# EAGLE design RGB_PMOLED_0.6IN (EAGLE 9.0.1)
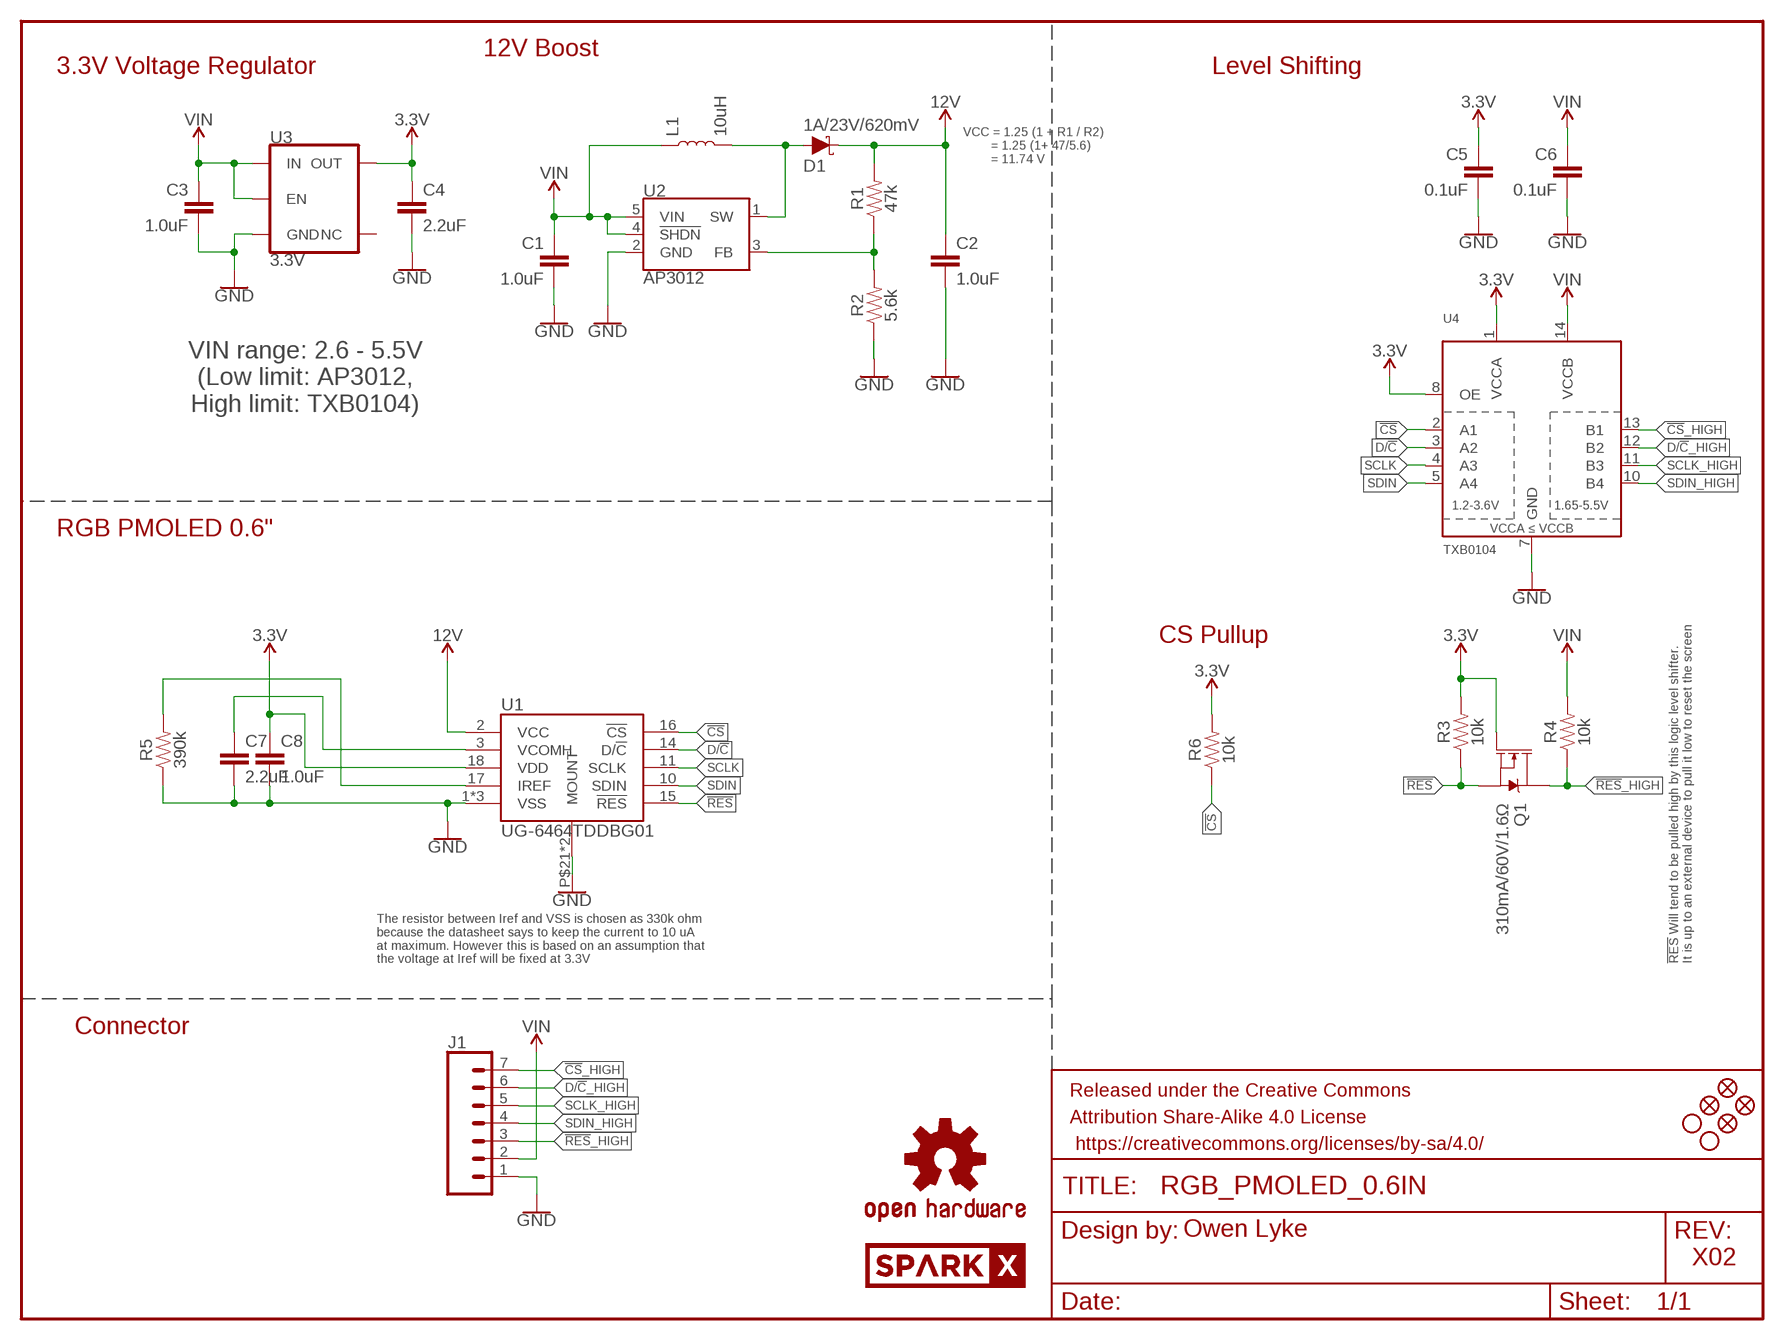
[diagram p0: schematic, sheet 1]

## Parts
C1  1.0uF  1.0UF-0603-16V-10%  [0603]
C2  1.0uF  1.0UF-0603-16V-10%  [0603]
C3  1.0uF  1.0UF-0603-16V-10%  [0603]
C4  2.2uF  2.2UF-0603-10V-20%  [0603]
C5  0.1uF  0.1UF-0603-25V-(+80/-20%)  [0603]
C6  0.1uF  0.1UF-0603-25V-(+80/-20%)  [0603]
C7  2.2uF  2.2UF-0805-25V-(+80/-20%)  [0805]
C8  1.0uF  1.0UF-0603-16V-10%  [0603]
D1  1A/23V/620mV  DIODE-SCHOTTKY-BAT20J  [SOD-323]
FD1  FIDUCIAL1X2  [FIDUCIAL-1X2]
FD2  FIDUCIAL1X2  [FIDUCIAL-1X2]
FD3  FIDUCIAL1X2  [FIDUCIAL-1X2]
FD4  FIDUCIAL1X2  [FIDUCIAL-1X2]
FRAME1  FRAME-LETTER  [CREATIVE_COMMONS]
H1  STAND-OFF  [STAND-OFF]
H2  STAND-OFF  [STAND-OFF]
J1  CONN_07NO_SILK  [1X07_NO_SILK]
L1  10uH  INDUCTOR-CDRH-10UH  [INDUCTOR_4.7UH]
LOGO1  SPARKX-LOGO5  [SPARKX-LARGE]
LOGO2  OSHW-LOGOS  [OSHW-LOGO-S]
Q1  310mA/60V/1.6Ω  MOSFET-NCH-2N7002PW  [SOT323]
R1  47k  47KOHM-0603-1/10W-1%  [0603]
R2  5.6k  5.6KOHM-0603-1/10W-1%  [0603]
R3  10k  10KOHM-0603-1/10W-1%  [0603]
R4  10k  10KOHM-0603-1/10W-1%  [0603]
R5  390k  390KOHM-0603-1/10W-1%  [0603]
R6  10k  10KOHM-0603-1/10W-1%  [0603]
U1  UG-6464TDDBG01  [AMPHENOL_10051922-2010ELF]
U2  AP3012  [SOT23-5]
U3  3.3V  V_REG_AP2112K-3.3V  [SOT23-5]
U4  TXB0104  TXB0104PWRSOIC14  [SO14]

## Nets
3.3V: C4.1 C5.1 C8.1 Q1.1(G) R3.2 R6.2 U1.18(VDD) U3.5(OUT) U4.1(VCCA) U4.8(OE)
12V: C2.1 D1.C R1.2 U1.2(VCC)
!CS: R6.1 U1.16(!CS) U4.2(A1)
!CS!_HIGH: J1.7 U4.13(B1)
!RES: Q1.2(S) R3.1 U1.15(!RES)
!RES!_HIGH: J1.3 Q1.3(D) R4.1
D/!C: U1.14(D/!C) U4.3(A2)
D/!C!_HIGH: J1.6 U4.12(B2)
GND: C1.2 C2.2 C3.2 C4.2 C5.2 C6.2 C7.2 C8.2 J1.1 R2.1 R5.1 U1.1(VSS) U1.19(VSS) U1.20(VSS) U1.P$21(MOUNT) U1.P$22(MOUNT) U2.2(GND) U3.2(GND) U4.7(GND)
N$2: D1.A L1.P$2 U2.1(SW)
N$3: R1.1 R2.2 U2.3(FB)
N$5: C7.1 U1.3(VCOMH)
N$11: R5.2 U1.17(IREF)
SCLK: U1.11(SCLK) U4.4(A3)
SCLK_HIGH: J1.5 U4.11(B3)
SDIN: U1.10(SDIN) U4.5(A4)
SDIN_HIGH: J1.4 U4.10(B4)
VIN: C1.1 C3.1 C6.1 J1.2 L1.P$1 R4.2 U2.4(!SHDN!) U2.5(VIN) U3.1(IN) U3.3(EN) U4.14(VCCB)
Unconnected: U3.4(NC)

## Notes on the sheet
- 12V Boost
- 3.3V Voltage Regulator | Level Shifting
- VCC = 1.25 (1 + R1 / R2)
          = 1.25 (1+ 47/5.6)
          = 11.74 V
- VIN range: 2.6 - 5.5V
  (Low limit: AP3012,
  High limit: TXB0104)
- RGB PMOLED 0.6"
- CS Pullup
- The resistor between Iref and VSS is chosen as 330k ohm 
  because the datasheet says to keep the current to 10 uA 
  at maximum. However this is based on an assumption that 
  the voltage at Iref will be fixed at 3.3V
- !RES! Will tend to be pulled high by this logic level shifter. 
  It is up to an external device to pull it low to reset the screen
- Connector
- Owen Lyke
- X02

## Library data of the parts
C1-C3 C8 = SparkFun-Capacitors:1.0UF: 1µF ceramic capacitors A capacitor is a passive two-terminal electrical component used to store electrical energy temporarily in an electric field.; PROD_ID: CAP-00868
C4 = SparkFun-Capacitors:2.2UF: 2.2µF ceramic capacitors A capacitor is a passive two-terminal electrical component used to store electrical energy temporarily in an electric field.; PROD_ID: CAP-07888
C5 C6 = SparkFun-Capacitors:0.1UF: 0.1µF ceramic capacitors A capacitor is a passive two-terminal electrical component used to store electrical energy temporarily in an electric field.; PROD_ID: CAP-00810
C7 = SparkFun-Capacitors:2.2UF: 2.2µF ceramic capacitors A capacitor is a passive two-terminal electrical component used to store electrical energy temporarily in an electric field.; PROD_ID: CAP-11624
D1 = SparkFun-DiscreteSemi:DIODE-SCHOTTKY: Schottky diode A Schottky diode is a semiconductor diode which has a low forward voltage drop and a very fast switching action.; PROD_ID: DIO-11623
FD1-FD4 = SparkFun-Aesthetics:FIDUCIAL: Fiducial Alignment Points Point-of-reference for pick-and-place machines and other optical instruments.
FRAME1 = SparkFun-Aesthetics:FRAME-LETTER: Schematic Frame - Letter Standard 8.5x11 US Letter frame
H1 H2 = SparkFun-Hardware:STAND-OFF: Stand Off Drill holes for mechanically mounting via screws, standoffs, etc. Note: Use the keepout ring to avoid running the screw head into surrounding components. Variant Overviews STAND-OFF - Mechanical footprint for a #4 phillips button head screw. STAND-OFF-TIGHT - Mechanical footprint for a #4 phillips button head screw, Example SparkFun Products Screw - Phillips Head (1/4", 4-40, 10 pack) <https://www.sparkfun.com/products/10453> (PRT-10453) Screw - Phillips Head (1/2", 4-40, 10 pack) <https://www.sparkfun.com/products/10452> (PRT-10452) Screw - Phillips Head (3/4", 4-40, 10 pack) <https://www.sparkfun.com/products/10451> (PRT-10451) Screw - Phillips Head (1", 4-40, 10 pack) <https://www.sparkfun.com/products/10450> (PRT-10450)
J1 = SparkFun-Connectors:CONN_07: Multi connection point. Often used as Generic Header-pin footprint for 0.1 inch spaced/style header connections On any of the 0.1 inch spaced packages, you can populate with these: Break Away Headers - Straight <https://www.sparkfun.com/products/116> (PRT-00116) Break Away Male Headers - Right Angle <https://www.sparkfun.com/products/553> (PRT-00553) Female Headers <https://www.sparkfun.com/products/115> (PRT-00115) Break Away Headers - Machine Pin <https://www.sparkfun.com/products/117> (PRT-00117) Break Away Female Headers - Swiss Machine Pin <https://www.sparkfun.com/products/743> (PRT-00743) For SCREWTERMINALS and SPRING TERMINALS visit here: Screw Terimnals on SparkFun.com <https://www.sparkfun.com/search/results?term=Screw+Terminals> (5mm/3.5mm/2.54mm spacing) This device is also useful as a general connection point to wire up your design to another part of your project. Our various solder wires solder well into these plated through hole pads. Hook-Up Wire - Assortment (Stranded, 22 AWG) <https://www.sparkfun.com/products/11375> (PRT-11375) Hook-Up Wire - Assortment (Solid Core, 22 AWG) <https://www.sparkfun.com/products/11367> (PRT-11367) View the entire wire category on our website here <https://www.sparkfun.com/categories/141> Special notes: Molex polarized connector foot print use with SKU : PRT-08231 with associated crimp pins and housings. 1MM SMD Version SKU: PRT-10208 NOTES ON THE VARIANTS LOCK and LOCK_LONGPADS... This footprint was designed to help hold the alignment of a through-hole component (i.e. 6-pin header) while soldering it into place. You may notice that each hole has been shifted either up or down by 0.005 of an inch from it's more standard position (which is a perfectly straight line). This slight alteration caused the pins (the squares in the middle) to touch the edges of the holes. Because they are alternating, it causes a "brace" to hold the component in place. 0.005 has proven to be the perfect amount of "off-center" position when using our standard breakaway headers. Although looks a little odd when you look at the bare footprint, once you have a header in there, the alteration is very hard to notice. Also,if you push a header all the way into place, it is covered up entirely on the bottom side.
L1 = SparkFun-Coils:INDUCTOR: Inductors Resist changes in electrical current. Basically a coil of wire. SparkFun Products: SparkFun Load Cell Amplifier - HX711 <https://www.sparkfun.com/products/13879> IOIO-OTG - V2.2 <https://www.sparkfun.com/products/13613>; PROD_ID: NDUC-13968
LOGO1 = 1.81_Greyscale_OLED_Breakout:SPARKX-LOGO
LOGO2 = SparkFun-Aesthetics:OSHW-LOGO: Open-Source Hardware (OSHW) Logo This logo indicates the piece of hardware it is found on incorporates a OSHW license and/or adheres to the definition of open source hardware found here: http://freedomdefined.org/OSHW
Q1 = SparkFun-DiscreteSemi:MOSFET-NCH: N-channel MOSFETs Voltage controlled devices that allow control of high current outputs. SparkFun Products: SparkFun OpenScale <https://www.sparkfun.com/products/13261> SparkFun Digital Sandbox <https://www.sparkfun.com/products/12651> SparkFun Monster Moto Shield <https://www.sparkfun.com/products/10182> SparkFun MOSFET Power Controller <https://www.sparkfun.com/products/11214>; PROD_ID: TRANS-11151
R1 = SparkFun-Resistors:47KOHM: 47kΩ resistor A resistor is a passive two-terminal electrical component that implements electrical resistance as a circuit element. Resistors act to reduce current flow, and, at the same time, act to lower voltage levels within circuits. - Wikipedia; PROD_ID: RES-07871
R2 = SparkFun-Resistors:5.6KOHM: 5.6kΩ resistor A resistor is a passive two-terminal electrical component that implements electrical resistance as a circuit element. Resistors act to reduce current flow, and, at the same time, act to lower voltage levels within circuits. - Wikipedia; PROD_ID: RES-12378
R3 R4 R6 = SparkFun-Resistors:10KOHM: 10kΩ resistor A resistor is a passive two-terminal electrical component that implements electrical resistance as a circuit element. Resistors act to reduce current flow, and, at the same time, act to lower voltage levels within circuits. - Wikipedia; PROD_ID: RES-00824
R5 = SparkFun-Resistors:390KOHM: 390kΩ resistor A resistor is a passive two-terminal electrical component that implements electrical resistance as a circuit element. Resistors act to reduce current flow, and, at the same time, act to lower voltage levels within circuits. - Wikipedia; PROD_ID: RES-12024
U1 = RGB_OLED:UG-6464TDDBG01
U2 = SparkFun-IC-Power:AP3012: AP3012 The AP3012 is a high power, constant frequency, current mode PWM, inductor based, step-up (boost) converter. The converter operates at high frequency (1.5MHz) so that a small, low profile inductor can be used. Datasheet <https://www.diodes.com/assets/Datasheets/AP3012.pdf>; PROD_ID: VREG-13911
U3 = SparkFun-IC-Power:V_REG_AP2112: AP2112 - 600mA CMOS LDO Regulator w/ Enable The AP2112 is CMOS process low dropout linear regulator with enable function, the regulator delivers a guaranteed 600mA (min.) continuous load current. Features Output Voltage Accuracy: ±1.5% Output Current: 600mA (Min.) Foldback Short Current Protection: 50mA Enable Function to Turn ON/OFF VOUT Low Dropout Voltage (3.3V): 250mV (Typ.) @IOUT=600mA Excellent Load Regulation: 0.2%/A (Typ.) Excellent Line Regulation: 0.02%/V (Typ.) Low Quiescent Current: 55μA (Typ.) Low Standby Current: 0.01μA (Typ.) Low Output Noise: 50μVRMS PSRR: 100Hz -65dB, 1kHz -65dB OTSD Protection Stable with 1.0μF Flexible Cap: Ceramic, Tantalum and Aluminum Electrolytic Operation Temperature Range: -40°C to 85°C ESD: MM 400V, HBM 4000V; PROD_ID: VREG-12457
U4 = SparkFun-IC-Comms:TXB0104PWR: 4-Bit Bi-Directional Level Shifter 1.2V-3.6V (VCCA) to 1.65V-5.5V (VCCB) bi-directional level shifter with auto direction sensing. Max data rate - VCCA 1.8V: 20Mbps (50ns), VCCA 3.3V: 100Mbps (10ns) Digikey: 296-21929-1-ND (TSSOP) Datasheet <http://cdn.sparkfun.com/datasheets/BreakoutBoards/txb0104.pdf> SparkFun Products SparkFun Cellular Shield - MG2639 <https://www.sparkfun.com/products/13120> (CEL-13120) SparkFun Level Shifting microSD Breakout <https://www.sparkfun.com/products/13743> (DEV-13743) SparkFun Voltage-Level Translator Breakout - TXB0104 <https://www.sparkfun.com/products/11771> (BOB-11771) SparkFun Block for Intel® Edison - UART <https://www.sparkfun.com/products/13040> (DEV-13040) SparkFun Block for Intel® Edison - Arduino <https://www.sparkfun.com/products/13036> (DEV-13036); PROD_ID: IC-11329

## Board
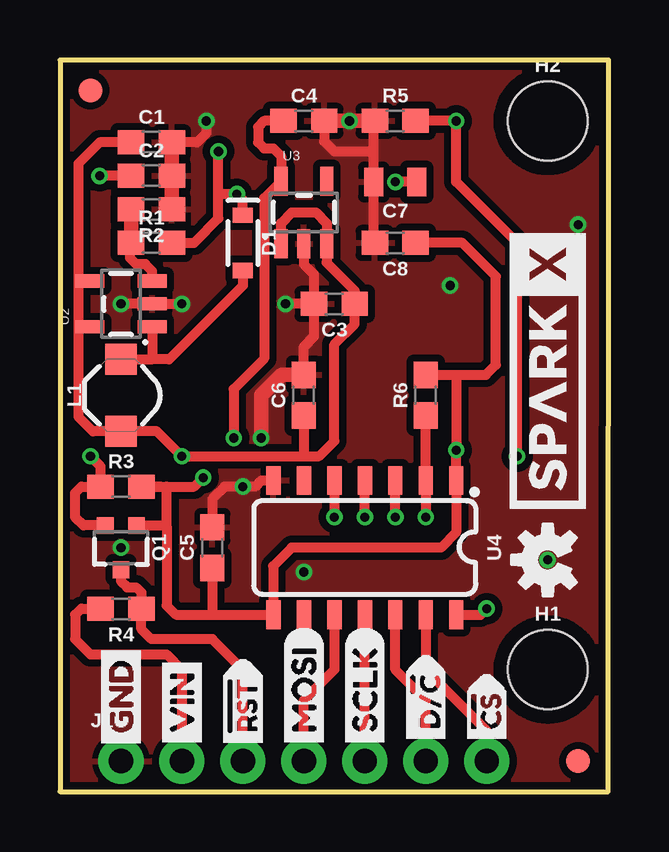
[diagram p1: board, top side]
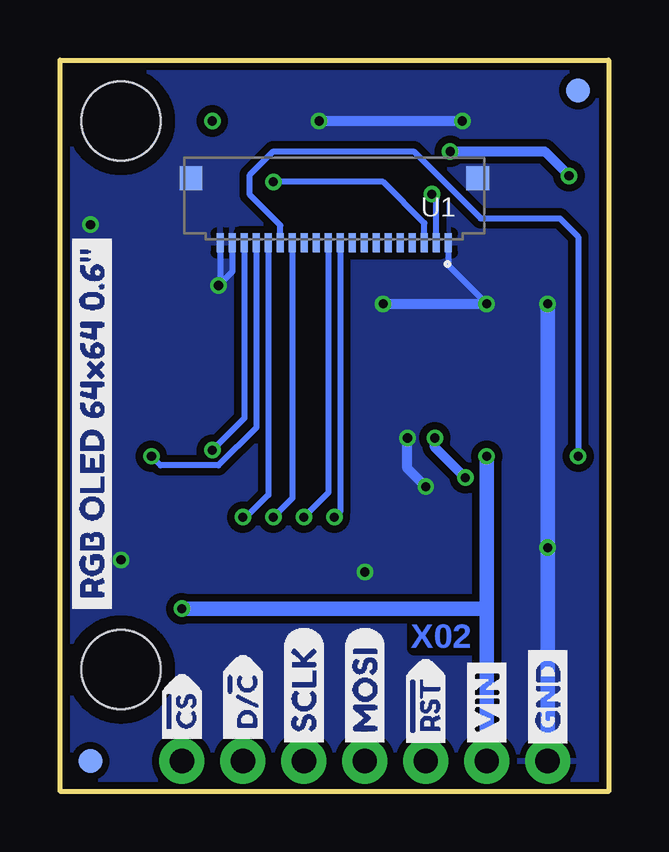
[diagram p2: board, bottom side, seen from below]

Size 22.86 x 30.48 mm. Coordinates in mm from the lower left corner, seen from the top.
Outline: 0,0 22.84,0 22.86,30.48 0,30.48 0,0
Copper layers (1*16): Top 0.035mm / dielectric 1.5mm / Bottom 0.035mm
Design rules "SparkFun-2-layer-PCBWay-LIMIT": minimum track width 6mil, minimum drill 0.3mm, track to track 6mil, track to pad 6mil, pad to pad 6mil, via to via 6mil, smd to smd 6mil, copper to edge 6mil, drill to drill 6mil, minimum pad ring 6mil, minimum via ring 6mil, stop-mask expansion 4mil, vias tented up to drill 25mil, thermal gap 10mil

### Footprints (pad centres in the part's own frame; a part is rotated, then mirrored left to right if it is on the bottom)
0603 = smd 1.1 x 1: 1 -0.85,0; 2 0.85,0
0805 = smd 0.8 x 1.2: 1 -0.9,0; 2 0.9,0
SOD-323 = smd 0.63 x 0.83: A 1.15,0; C -1.15,0
FIDUCIAL-1X2 = smd 1 x 1: 1 0,0
STAND-OFF = hole 3.302: 0,0
1X07_NO_SILK = drill 1.016 pad 1.88: 1 0,0; 2 2.54,0; 3 5.08,0; 4 7.62,0; 5 10.16,0; 6 12.7,0; 7 15.24,0
INDUCTOR_4.7UH = smd 1.3 x 1.3: P$1 -1.5,0; P$2 1.5,0
SOT323 = smd 0.7 x 0.7: 1 -0.65,-0.925; 2 0.65,-0.925; 3 0,0.925
AMPHENOL_10051922-2010ELF = smd 0.3 x 0.8: 1 -4.75,0; 2 -4.25,0; 3 -3.75,0; 4 -3.25,0; 5 -2.75,0; 6 -2.25,0; 7 -1.75,0; 8 -1.25,0; 9 -0.75,0; 10 -0.25,0; 11 0.25,0; 12 0.75,0; 13 1.25,0; 14 1.75,0; 15 2.25,0; 16 2.75,0; 17 3.25,0; 18 3.75,0; 19 4.25,0; 20 4.75,0 | smd 0.95 x 1: P$21 -5.975,-2.7; P$22 5.975,-2.7
SOT23-5 = smd 0.55 x 1.2: 1 -0.95,-1.3; 2 0,-1.3; 3 0.95,-1.3; 4 0.95,1.3; 5 -0.95,1.3
SO14 = smd 0.6 x 1.2: 1 -3.81,-2.8; 2 -2.54,-2.8; 3 -1.27,-2.8; 4 0,-2.8; 5 1.27,-2.8; 6 2.54,-2.8; 7 3.81,-2.8; 8 3.81,2.8; 9 2.54,2.8; 10 1.27,2.8; 11 0,2.8; 12 -1.27,2.8; 13 -2.54,2.8; 14 -3.81,2.8

### Placement (x,y rotation side)
C1  3.81,27.05 0 top
C2  3.81,25.65 0 top
C3  11.43,20.32 180 top
C4  10.16,27.94 0 top
C5  6.35,10.16 90 top
C6  10.16,16.51 90 top
C7  13.97,25.4 180 top
C8  13.97,22.86 180 top
D1  7.62,22.86 270 top
FD1  1.27,29.21 0 top
FD2  21.59,1.27 0 top
FD3  21.59,1.27 0 bottom
FD4  1.27,29.21 0 bottom
FRAME1  -11.43,-13.97 0 top  (outside the outline)
H1  20.32,5.08 0 top
H2  20.32,27.94 0 top
J1  2.54,1.27 0 top
L1  2.54,16.51 90 top
LOGO1  20.32,17.53 90 top
LOGO2  20.32,9.65 90 top
Q1  2.54,10.16 180 top
R1  3.81,22.86 0 top
R2  3.81,24.26 180 top
R3  2.54,12.7 0 top
R4  2.54,7.62 180 top
R5  13.97,27.94 0 top
R6  15.24,16.51 90 top
U1  11.43,22.86 180 bottom
U2  2.54,20.32 90 top
U3  10.16,24.13 0 top
U4  12.7,10.16 180 top
U$1  [VIN0]  5.08,1.52 90 top
U$2  [VIN0]  5.08,1.52 90 bottom
U$3  [MOSI1]  10.16,1.52 90 bottom
U$4  [MOSI1]  10.16,1.52 90 top
U$5  [SCLK2]  12.7,1.52 90 top
U$6  [SCLK2]  12.7,1.52 90 bottom
U$7  [GND1]  2.54,1.52 90 top
U$8  [GND1]  2.54,1.52 90 bottom
U$9  [D##C5]  15.24,1.52 90 top
U$10  [#RST0]  7.62,1.4 90 top
U$11  [#RST0]  7.62,1.4 90 bottom
U$12  [#CS6]  17.78,1.52 90 top
U$13  [#CS6]  17.78,1.52 90 bottom
U$14  [D##C5]  15.24,1.52 90 bottom
U$16  [RGB_OLED_64X64_0#6#7]  21.53,7.11 90 bottom

### Tracks (layer width: path | path; a pad name or v marks a point on that pad's centre or on a via)
3.3V  (via drill 0.38)
  Top 0.406: C4.1 8.51,27.94 8.26,27.69 8.26,27.05 8.51,26.8 8.89,26.8 9.21,26.48 U3.5 8.51,24.73 8.51,18.03 7.24,16.76 v7.24,14.73 | 4.19,12.7 R3.2 4.45,12.7 | U4.8 | U4.8 8.88,9.39 9.65,10.16 15.88,10.16 16.51,10.79 U4.1 v16.51,14.22 16.51,17.36 | 4.45,11.05 4.45,7.75 4.83,7.37 6.22,7.37 | 6.22,7.37 U4.8 | Q1.1 4.41,11.09 4.45,11.05 | C5.1 6.35,7.49 6.22,7.37 | 4.45,12.7 5.59,12.7 v5.97,13.08 | 4.45,11.05 4.45,12.7 | C8.1 16.76,22.86 18.16,21.46 18.16,17.78 17.74,17.36 16.51,17.36 | 16.04,17.36 R6.2 16.51,17.36
  Bottom 0.254: 16.38,14.1 v16.51,14.22 15.18,15.55 U1.18
  Bottom 0.406: v5.97,13.08 7.24,14.35 v7.24,14.73
12V  (via drill 0.38)
  Top 0.406: C2.1 v1.65,25.65 | R1.2 5.59,22.86 6.6,23.88 6.6,24.89 | 6.6,24.89 v6.6,26.67 | D1.C 7.62,24.64 v7.37,24.89 6.6,24.89
  Bottom 0.254: U1.2 7.18,24.71 v7.37,24.89
  Bottom 0.406: v6.6,26.67 2.67,26.67 v1.65,25.65
!CS  (via drill 0.38)
  Top 0.406: v15.24,11.43 U4.2 R6.1
  Bottom 0.254: v15.24,11.43 15.11,11.43 14.18,12.36 U1.16
!CS!_HIGH
  Top 0.406: J1.7 17.78,2.54 15.24,5.08 U4.13
!RES  (via drill 0.38)
  Top 0.406: Q1.2 0.98,11.09 0.64,11.43 0.64,12.45 0.89,12.7 R3.1 1.69,13.55 v1.27,13.97
  Bottom 0.254: v1.27,13.97 1.27,23.11 2.03,23.88 5.33,23.88 8.13,26.67 13.97,26.67 14.95,25.69 14.95,24.86 13.68,23.59 U1.15
!RES!_HIGH
  Top 0.406: Q1.3 2.54,8.76 2.79,8.51 3.17,8.51 3.39,8.29 R4.1 3.39,6.77 3.81,6.35 6.35,6.35 7.62,5.08 J1.3
D/!C  (via drill 0.38)
  Top 0.406: v13.97,11.43 U4.3
  Bottom 0.254: v13.97,11.43 13.18,12.22 U1.14
D/!C!_HIGH
  Top 0.406: J1.6 15.24,3.81 13.97,5.08 U4.12
GND  (via drill 0.38)
  Top 0.406: C6.2 10.16,18.54 10.58,18.96 C3.2 | U3.2 10.16,21.97 10.58,21.55 C3.2 | C8.2 13.07,22.91 C7.2 13.07,26.67 | 13.07,26.67 13.07,27.89 R5.1 | C4.2 11.01,27.09 11.43,26.67 13.07,26.67 | C5.2 6.35,12.19 6.86,12.7 v7.62,12.7 8.13,12.7 8.39,12.96 U4.7 | v2.54,20.32 U2.2 v5.08,20.32 | C3.2 v9.4,20.32 | v6.1,27.94 6.1,27.43 5.71,27.05 C1.2
  Top 0.61: R2.1 C2.2 C1.2 | C6.2 9.23,17.36 8.38,16.51 v8.38,14.73 | C4.2 v12.06,27.94 R5.1
  Bottom 0.254: U1.1 6.68,21.92 v5.08,20.32 | U1.20 16.18,21.16 | 16.18,21.16 v16.26,21.08 | U1.19 15.68,21.66 16.18,21.16
  Bottom 0.406: v7.62,12.7 8.38,13.46 v8.38,14.73 | v9.4,20.32 v5.08,20.32 | v12.06,27.94 v6.1,27.94
  Bottom 0.61: J1.1 v2.54,10.16 v2.54,20.32
  other vias: 20.32,9.65 21.59,23.62 10.16,9.14
  pour Top (isolate 0.305): 22.86,0 22.86,30.48 0,30.48 0,0
  pour Bottom (isolate 0.305): 22.86,0 22.86,30.48 0,30.48 0,0
  pour Bottom (isolate 0.305, no thermals): 6.6,25.15 6.6,26.67 2.79,26.67 2.03,25.91 2.03,23.88 5.33,23.88
  pour Bottom (isolate 0.305, no thermals): 15.24,27.69 15.24,23.62 19.56,23.62 19.56,27.69
N$2
  Top 0.406: L1.P$2 3.81,18.01 | 3.81,18.01 4.55,18.01 7.62,21.08 D1.A | U2.1 3.84,18.04 3.81,18.01
N$3
  Top 0.406: U2.3 3.84,21.69 3.56,21.97 3.17,21.97 2.92,22.23 2.92,22.82 R1.1
  Top 0.61: R1.1 R2.2
N$5  (via drill 0.38)
  Top 0.406: C7.1 v13.97,25.4
  Bottom 0.254: U1.3 7.68,23.68 9.4,25.4 v13.97,25.4
N$11  (via drill 0.38)
  Top 0.406: R5.2 v16.51,27.94 16.51,25.4 19.05,22.86 v19.05,13.97
  Bottom 0.254: v19.05,13.97 18.67,13.59 16.26,13.59 14.68,15.16 U1.17
SCLK  (via drill 0.38)
  Top 0.406: v12.7,11.43 U4.4
  Bottom 0.254: U1.11 11.68,12.45 v12.7,11.43
SCLK_HIGH
  Top 0.406: J1.5 U4.11
SDIN  (via drill 0.38)
  Top 0.406: U4.5 v11.43,11.43
  Bottom 0.254: U1.10 11.18,11.68 v11.43,11.43
SDIN_HIGH
  Top 0.406: J1.4 10.16,3.81 11.43,5.08 U4.10
VIN  (via drill 0.38)
  Top 0.406: C1.1 1.65,27.05 0.76,26.16 0.76,21.21 | U3.1 9.21,23.69 9.65,24.13 10.67,24.13 11.11,23.69 U3.3 11.11,22.04 12.28,20.87 C3.1 12.28,19.48 11.43,18.63 11.43,14.61 10.79,13.97 10.16,13.97 | U4.14 17.52,7.36 v17.78,7.62 | R4.2 0.89,7.62 0.64,7.37 0.64,6.35 1.27,5.71 4.45,5.71 5.08,5.08 J1.2 | 0.76,21.21 0.76,19.43 | 0.76,19.43 0.76,15.62 1.37,15.01 L1.P$1 4.04,15.01 v5.08,13.97 10.16,13.97 | C6.1 10.16,13.97 | U2.4 0.82,21.27 0.76,21.21 | U2.5 0.82,19.37 0.76,19.43
  Bottom 0.61: 5.08,6.35 J1.2 5.08,7.62 | 5.08,7.62 v5.08,13.97 | v17.78,7.62 5.08,7.62

### Text on the board
Bottom: X02
tDocu: Owen Lyke